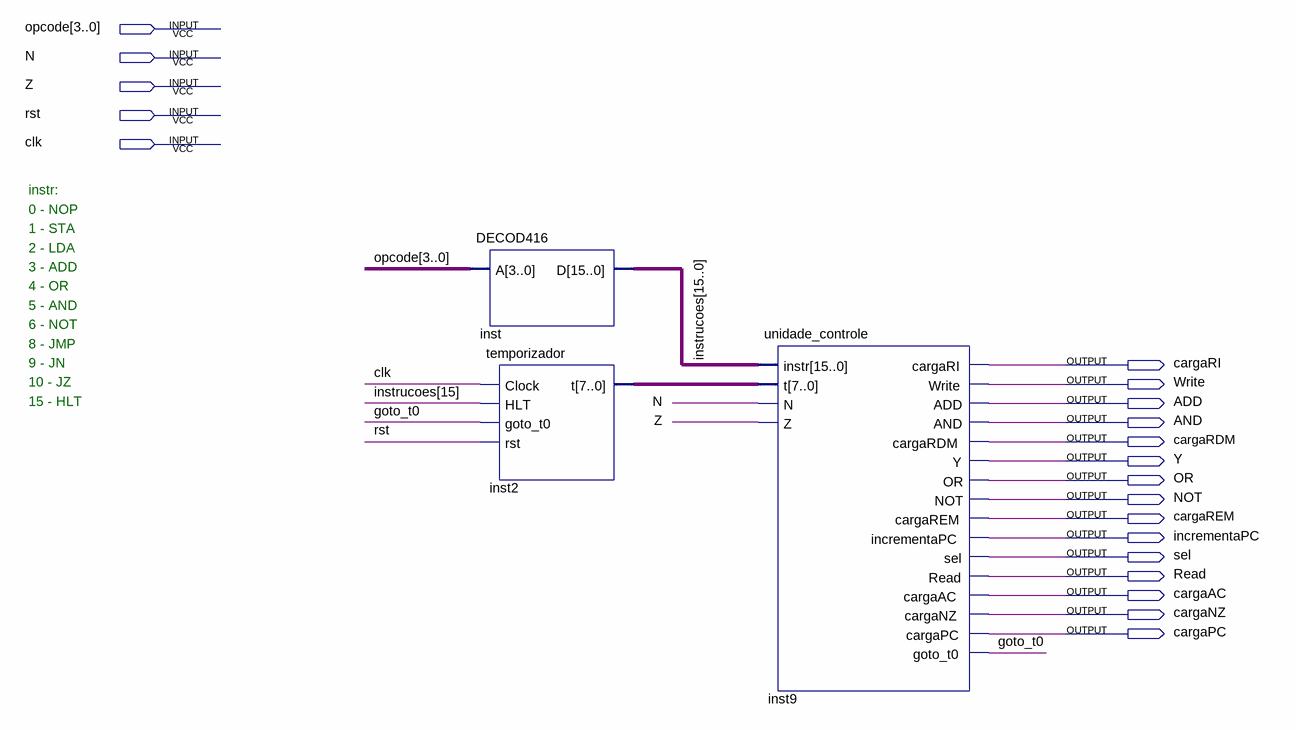
[diagram p0: schematic sheet]
// Quartus schematic lab09.bdf as structural Verilog: 3 symbols, 20 pins
module lab09 (
  input  [3:0] opcode,
  input  N,
  input  Z,
  input  rst,
  input  clk,
  output cargaRI,
  output Write,
  output ADD,
  output AND,
  output cargaRDM,
  output Y,
  output OR,
  output NOT,
  output cargaREM,
  output incrementaPC,
  output sel,
  output Read,
  output cargaAC,
  output cargaNZ,
  output cargaPC
);

  wire goto_t0;
  wire [7:0] inst2_t;
  wire [15:0] instrucoes;

  DECOD416 inst (.A(opcode), .D(instrucoes));
  temporizador inst2 (.Clock(clk), .HLT(instrucoes[15]), .goto_t0(goto_t0), .rst(rst), .t(inst2_t));
  unidade_controle inst9 (
    .instr(instrucoes), .t(inst2_t), .N(N), .Z(Z), .cargaRI(cargaRI), .Write(Write), .ADD(ADD), .AND(AND),
    .cargaRDM(cargaRDM), .Y(Y), .OR(OR), .NOT(NOT), .cargaREM(cargaREM), .incrementaPC(incrementaPC),
    .sel(sel), .Read(Read), .cargaAC(cargaAC), .cargaNZ(cargaNZ), .cargaPC(cargaPC), .goto_t0(goto_t0));

  // Notes on the sheet:
  //   instr:
  //   0 - NOP
  //   1 - STA
  //   2 - LDA
  //   3 - ADD
  //   4 - OR
  //   5 - AND
  //   6 - NOT
  //   8 - JMP
  //   9 - JN
  //   10 - JZ
  //   15 - HLT
endmodule
